# Altium schematic sheet 555Timer.SchDoc
size A
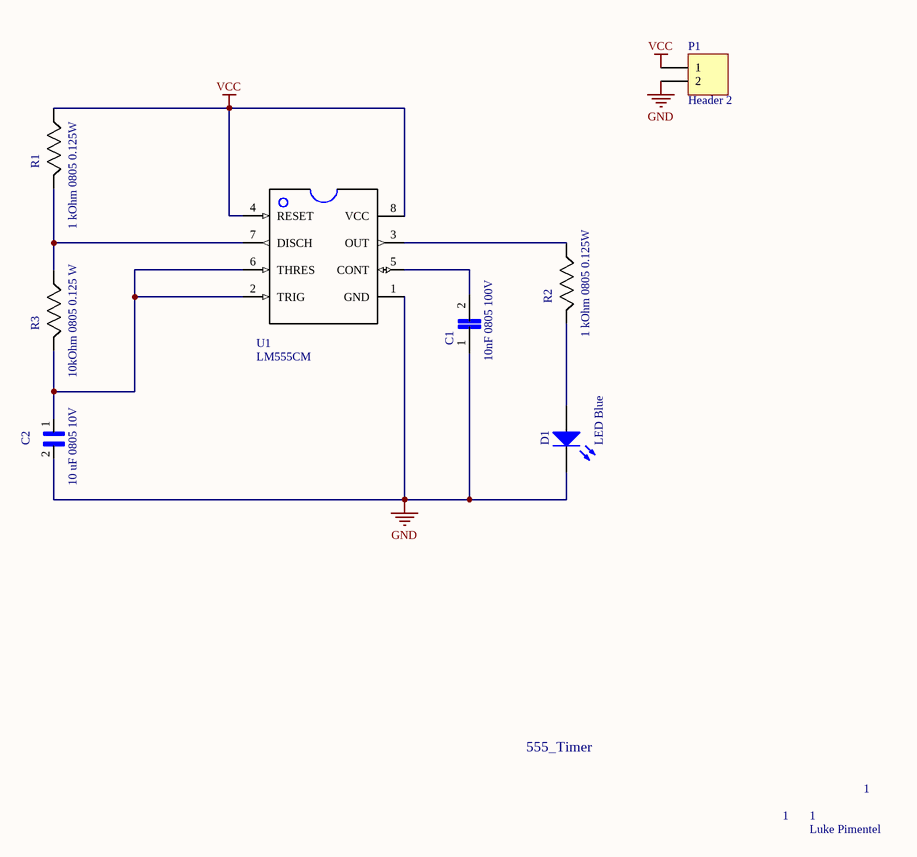
[diagram p0: 555Timer.SchDoc]

## Parts
C1  10nF 0805 100V  [C0805]
C2  10 uF 0805 10V  [C0805]
D1  LED Blue  [LED1206]
P1  Header 2  [HDR1X2]
R1  1 kOhm 0805 0.125W  [R0805]
R2  1 kOhm 0805 0.125W  [R0805]
R3  10kOhm 0805 0.125 W  [R0805]
U1  LM555CM  [SO08]

## Nets
GND: C1.1 C2.2 D1.2(C) P1.2 U1.1(GND)
VCC: P1.1 R1.2 U1.4(RESET) U1.8(VCC)
NetC1_2: C1.2 U1.5(CONT)
NetC2_1: C2.1 R3.1 U1.2(TRIG) U1.6(THRES)
NetD1_1: D1.1(A) R2.1
NetR1_1: R1.1 R3.2 U1.7(DISCH)
NetR2_2: R2.2 U1.3(OUT)

## Notes on the sheet
- 555_Timer
- 1
- Luke Pimentel

## Library data of the parts
C1 = GRM21BR72A103KA01L: 0805 10 nF 100 V ±10% Tolerance X7R SMT Multilayer Ceramic Capacitor; MF: Murata; Package: 0805 Murata; MP: GRM21BR72A103KA01L; Price: None; Availability: Unavailable; Value: *
C2 = GCM21BR71A106KE22L: 0805 10 uF 10 V ±10 % Tolerance X7R Surface Mount Multilayer Ceramic Capacitor; MF: Murata; Package: 0805 Murata; MP: GCM21BR71A106KE22L; Price: None; Availability: Unavailable; Value: *
D1 = SM1206UV-405-IL: SM1206 Series Blue 30° Water Clear 408 nm 3.4 V 1206 Surface Mount LED; Published: 8-Jun-2000; LatestRevisionDate: 17-Jul-2002; LatestRevisionNote: Re-released for DXP Platform.; PackageVersion: Feb-2002; PackageDescription: SM LED; 2 Flat Leads
P1 = Header 2: Header, 2-Pin; LatestRevisionDate: 17-Jul-2002; LatestRevisionNote: Re-released for DXP Platform.; Publisher: Altium Limited
R1 R2 = RC0805JR-071KL: RC Series 0805 0.125 W 1 kOhms 1%  ±100 ppm/°C SMT Thick Film Chip Resistor; MF: Yageo; MP: RC0805FR-0710KL; Package: 0805 Yageo; Price: None; Availability: Unavailable; Value: *
R3 = RC0805FR-0710KL: RC Series 0805 0.125 W 10 kOhms 1% ±100 ppm/°C SMT Thick Film Chip Resistor; MF: Yageo; Package: 0805 Yageo; MP: RC0805FR-0710KL; Price: None; Availability: Unavailable; Value: *
U1 = LM555CM: 555 SOIC; MF: Texas Instruments; Package: SOIC-8 Texas Instruments; MP: LM555CM; Price: None; Availability: Unavailable; Value: *